# EAGLE design ILI9342 BREAKOUT (EAGLE 9.2.2)
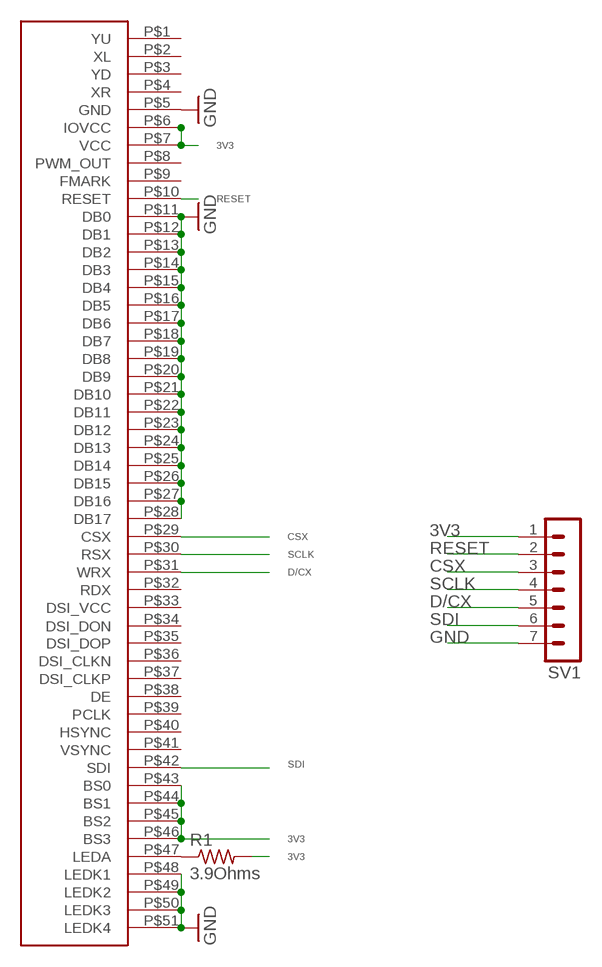
[diagram p0: schematic, sheet 1]

## Parts
2.6ILI9342  TFT-DISPLAY-2.6-51PIN  [TFT-DISPLAY-2.6-51PIN]
R1  3.9Ohms  R-US_R0805  [R0805]
SV1  MA07-1  [MA07-1]

## Nets
3V3: 2.6ILI9342.P$6(IOVCC) 2.6ILI9342.P$7(VCC) 2.6ILI9342.P$43(BS0) 2.6ILI9342.P$44(BS1) 2.6ILI9342.P$45(BS2) 2.6ILI9342.P$46(BS3) R1.2 SV1.1
CSX: 2.6ILI9342.P$29(CSX) SV1.3
D/CX: 2.6ILI9342.P$31(WRX) SV1.5
GND: 2.6ILI9342.P$5(GND) 2.6ILI9342.P$11(DB0) 2.6ILI9342.P$12(DB1) 2.6ILI9342.P$13(DB2) 2.6ILI9342.P$14(DB3) 2.6ILI9342.P$15(DB4) 2.6ILI9342.P$16(DB5) 2.6ILI9342.P$17(DB6) 2.6ILI9342.P$18(DB7) 2.6ILI9342.P$19(DB8) 2.6ILI9342.P$20(DB9) 2.6ILI9342.P$21(DB10) 2.6ILI9342.P$22(DB11) 2.6ILI9342.P$23(DB12) 2.6ILI9342.P$24(DB13) 2.6ILI9342.P$25(DB14) 2.6ILI9342.P$26(DB15) 2.6ILI9342.P$27(DB16) 2.6ILI9342.P$28(DB17) 2.6ILI9342.P$48(LEDK1) 2.6ILI9342.P$49(LEDK2) 2.6ILI9342.P$50(LEDK3) 2.6ILI9342.P$51(LEDK4) SV1.7
N$2: 2.6ILI9342.P$47(LEDA) R1.1
RESET: 2.6ILI9342.P$10(RESET) SV1.2
SCLK: 2.6ILI9342.P$30(RSX) SV1.4
SDI: 2.6ILI9342.P$42(SDI) SV1.6
Unconnected: 2.6ILI9342.P$1(YU) 2.6ILI9342.P$2(XL) 2.6ILI9342.P$3(YD) 2.6ILI9342.P$4(XR) 2.6ILI9342.P$8(PWM_OUT) 2.6ILI9342.P$9(FMARK) 2.6ILI9342.P$32(RDX) 2.6ILI9342.P$33(DSI_VCC) 2.6ILI9342.P$34(DSI_DON) 2.6ILI9342.P$35(DSI_DOP) 2.6ILI9342.P$36(DSI_CLKN) 2.6ILI9342.P$37(DSI_CLKP) 2.6ILI9342.P$38(DE) 2.6ILI9342.P$39(PCLK) 2.6ILI9342.P$40(HSYNC) 2.6ILI9342.P$41(VSYNC)

## Library data of the parts
2.6ILI9342 = 32teeth - 2.6_ TFT 51P:TFT-DISPLAY-2.6-51PIN: ILI9342 51P 2.6" TFT LCD
R1 = adafruit:R-US_: RESISTOR, American symbol
SV1 = con-lstb:MA07-1: PIN HEADER; OC_FARNELL: unknown; OC_NEWARK: unknown

## Board
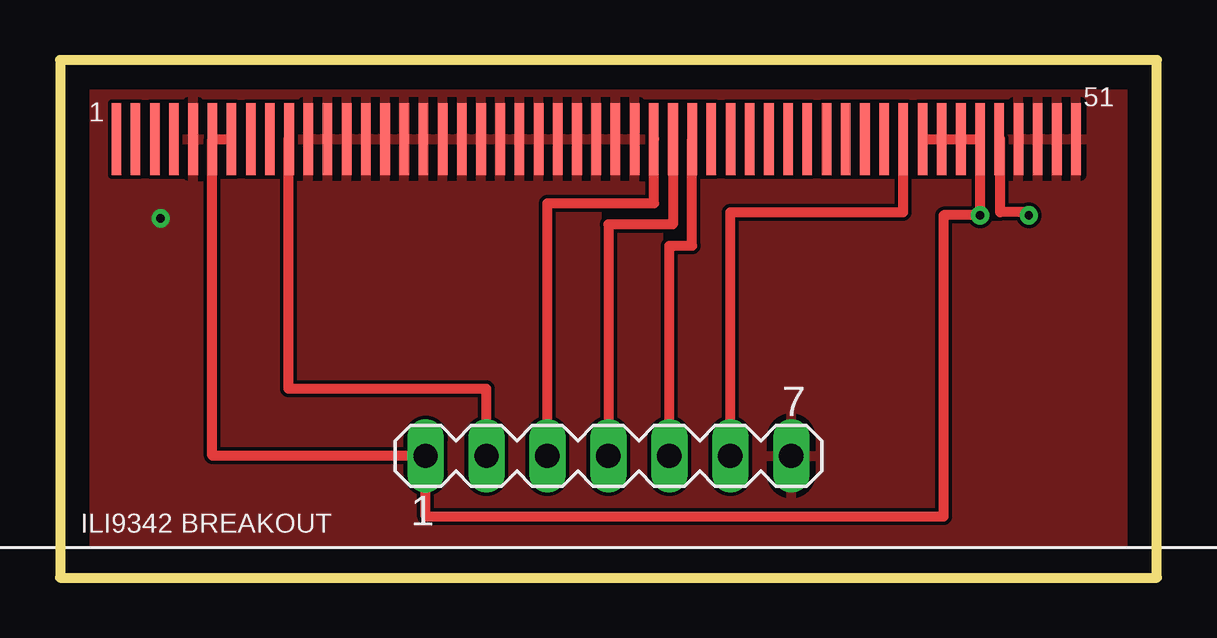
[diagram p1: board, top side]
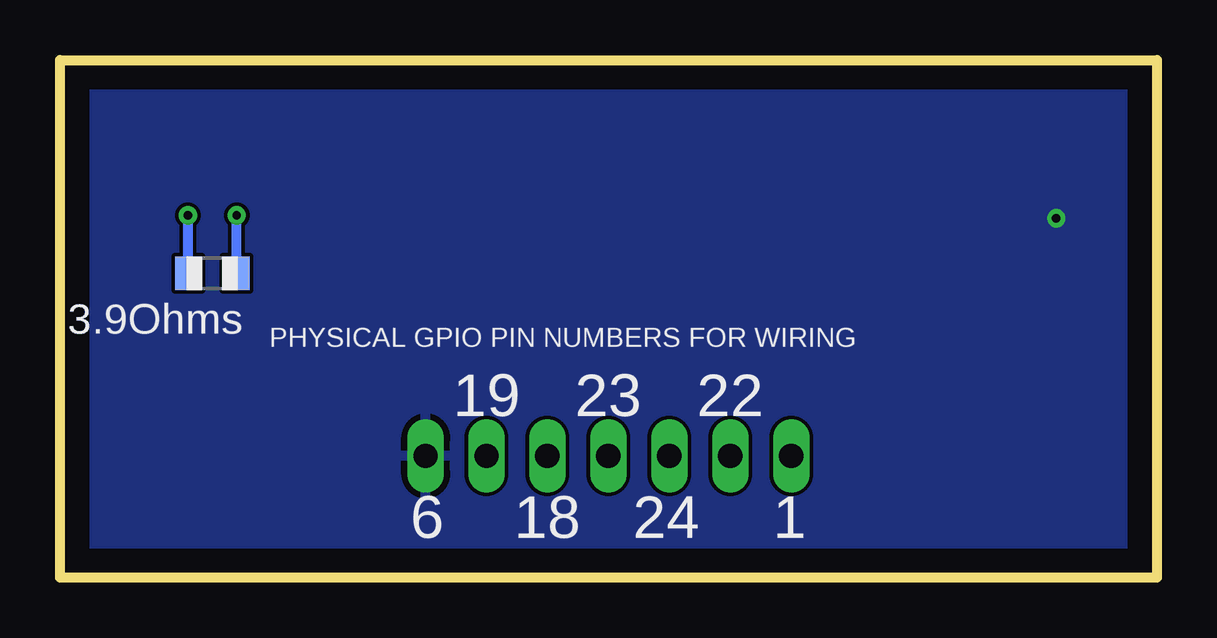
[diagram p2: board, bottom side, seen from below]

Size 45.72 x 21.59 mm. Coordinates in mm from the lower left corner, seen from the top.
Outline: 0,21.59 0,0 45.72,0 45.72,21.59 0,21.59
Copper layers (1*16): Top 0.035mm / dielectric 1.5mm / Bottom 0.035mm
Design rules "default": minimum track width 6mil, minimum drill 0.35mm, track to track 6mil, track to pad 6mil, pad to pad 6mil, via to via 6mil, smd to smd 6mil, copper to edge 40mil, drill to drill 6mil, minimum pad ring 10mil, minimum via ring 8mil, stop-mask expansion 4mil, vias tented up to drill 0mil, thermal gap 10mil

### Footprints (pad centres in the part's own frame; a part is rotated, then mirrored left to right if it is on the bottom)
TFT-DISPLAY-2.6-51PIN = smd 0.4 x 3: P$1 -20,-8.12; P$2 -19.2,-8.12; P$3 -18.4,-8.12; P$4 -17.6,-8.12; P$5 -16.8,-8.12; P$6 -16,-8.12; P$7 -15.2,-8.12; P$8 -14.4,-8.12; P$9 -13.6,-8.12; P$10 -12.8,-8.12; P$11 -12,-8.12; P$12 -11.2,-8.12; P$13 -10.4,-8.12; P$14 -9.6,-8.12; P$15 -8.8,-8.12; P$16 -8,-8.12; P$17 -7.2,-8.12; P$18 -6.4,-8.12; P$19 -5.6,-8.12; P$20 -4.8,-8.12; P$21 -4,-8.12; P$22 -3.2,-8.12; P$23 -2.4,-8.12; P$24 -1.6,-8.12; P$25 -0.8,-8.12; P$26 0,-8.12; P$27 0.8,-8.12; P$28 1.6,-8.12; P$29 2.4,-8.12; P$30 3.2,-8.12; P$31 4,-8.12; P$32 4.8,-8.12; P$33 5.6,-8.12; P$34 6.4,-8.12; P$35 7.2,-8.12; P$36 8,-8.12; P$37 8.8,-8.12; P$38 9.6,-8.12; P$39 10.4,-8.12; P$40 11.2,-8.12; P$41 12,-8.12; P$42 12.8,-8.12; P$43 13.6,-8.12; P$44 14.4,-8.12; P$45 15.2,-8.12; P$46 16,-8.12; P$47 16.8,-8.12; P$48 17.6,-8.12; P$49 18.4,-8.12; P$50 19.2,-8.12; P$51 20,-8.12
R0805 = smd 1.1 x 1.4: 1 -1,0; 2 1,0
MA07-1 = drill 1.016 long: 1 -7.62,0; 2 -5.08,0; 3 -2.54,0; 4 0,0; 5 2.54,0; 6 5.08,0; 7 7.62,0

### Placement (x,y rotation side)
2.6ILI9342  22.35,26.42 0 top
R1  39.37,12.7 0 bottom
SV1  22.86,5.08 0 top

### Tracks (layer width: path | path; a pad name or v marks a point on that pad's centre or on a via)
3V3  (via drill 0.35)
  Top 0.406: 2.6ILI9342.P$7 2.6ILI9342.P$6 6.35,5.08 SV1.1 15.24,2.54 36.83,2.54 36.83,15.11 v38.35,15.11 2.6ILI9342.P$46 2.6ILI9342.P$45 2.6ILI9342.P$44 2.6ILI9342.P$43
  Bottom 0.406: v38.35,15.11 38.37,15.11 R1.2
CSX
  Top 0.406: 2.6ILI9342.P$29 24.77,18.3 24.77,15.62 20.32,15.62 SV1.3
D/CX
  Top 0.406: SV1.5 25.4,13.84 26.35,13.84 2.6ILI9342.P$31
GND  (via drill 0.35)
  other vias: 4.19,14.99
  pour Top: 0,21.59 0,0 45.72,0 45.72,21.59
  pour Bottom: 0,21.59 45.72,21.59 45.72,0 0,0
N$2  (via drill 0.35)
  Top 0.406: v40.39,15.11 40.39,15.24 39.19,15.24 39.19,18.3 2.6ILI9342.P$47
  Bottom 0.406: R1.1 40.37,15.11 v40.39,15.11
RESET
  Top 0.406: 2.6ILI9342.P$10 9.53,18.3 9.53,7.87 17.78,7.87 SV1.2
SCLK
  Top 0.406: SV1.4 22.86,14.73 25.55,14.73 2.6ILI9342.P$30
SDI
  Top 0.406: SV1.6 27.94,15.24 35.15,15.24 2.6ILI9342.P$42

### Text on the board
tPlace: 51 | 1 | ILI9342 BREAKOUT
bPlace: 3.9Ohms | PHYSICAL GPIO PIN NUMBERS FOR WIRING | 22 | 23 | 19 | 1 | 24 | 18 | 6